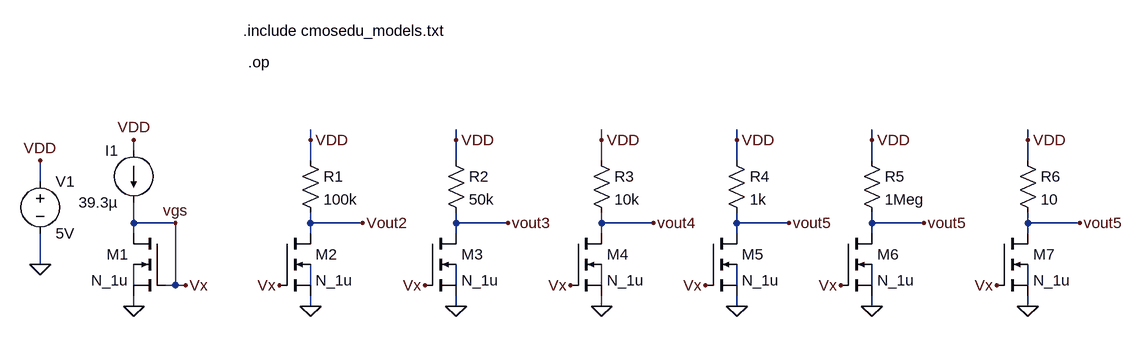
[diagram p0: schematic pt6.asc]
pt6.asc, the LTspice schematic file:
Version 4
SHEET 1 1736 680
WIRE 464 -64 464 -80
WIRE 688 -64 688 -80
WIRE 912 -64 912 -80
WIRE 1120 -64 1120 -80
WIRE 1328 -64 1328 -80
WIRE 1568 -64 1568 -80
WIRE 192 -48 192 -64
WIRE 464 -32 464 -64
WIRE 688 -32 688 -64
WIRE 912 -32 912 -64
WIRE 1120 -32 1120 -64
WIRE 1328 -32 1328 -64
WIRE 1568 -32 1568 -64
WIRE 48 0 48 -32
WIRE 192 64 192 32
WIRE 256 64 192 64
WIRE 464 64 464 48
WIRE 544 64 464 64
WIRE 688 64 688 48
WIRE 768 64 688 64
WIRE 912 64 912 48
WIRE 992 64 912 64
WIRE 1120 64 1120 48
WIRE 1200 64 1120 64
WIRE 1328 64 1328 48
WIRE 1408 64 1328 64
WIRE 1568 64 1568 48
WIRE 1648 64 1568 64
WIRE 192 80 192 64
WIRE 464 80 464 64
WIRE 688 80 688 64
WIRE 912 80 912 64
WIRE 1120 80 1120 64
WIRE 1328 80 1328 64
WIRE 1568 80 1568 64
WIRE 48 128 48 80
WIRE 192 160 192 128
WIRE 256 160 256 64
WIRE 256 160 240 160
WIRE 272 160 256 160
WIRE 464 160 464 128
WIRE 688 160 688 128
WIRE 912 160 912 128
WIRE 1120 160 1120 128
WIRE 1328 160 1328 128
WIRE 1568 160 1568 128
WIRE 192 192 192 176
WIRE 464 192 464 176
WIRE 688 192 688 176
WIRE 912 192 912 176
WIRE 1120 192 1120 176
WIRE 1328 192 1328 176
WIRE 1568 192 1568 176
FLAG 48 128 0
FLAG 192 192 0
FLAG 256 64 vgs
FLAG 48 -32 VDD
FLAG 192 -64 VDD
FLAG 464 192 0
FLAG 544 64 Vout2
FLAG 464 -64 VDD
FLAG 688 192 0
FLAG 768 64 vout3
FLAG 688 -64 VDD
FLAG 912 192 0
FLAG 992 64 vout4
FLAG 912 -64 VDD
FLAG 272 160 Vx
FLAG 416 160 Vx
FLAG 640 160 Vx
FLAG 864 160 Vx
FLAG 1120 192 0
FLAG 1200 64 vout5
FLAG 1120 -64 VDD
FLAG 1072 160 Vx
FLAG 1328 192 0
FLAG 1408 64 vout5
FLAG 1328 -64 VDD
FLAG 1280 160 Vx
FLAG 1568 192 0
FLAG 1648 64 vout5
FLAG 1568 -64 VDD
FLAG 1520 160 Vx
SYMBOL voltage 48 -16 R0
WINDOW 123 0 0 Left 2
WINDOW 39 0 0 Left 2
SYMATTR InstName V1
SYMATTR Value 5V
SYMBOL nmos4 240 80 M0
SYMATTR InstName M1
SYMATTR Value N_1u
SYMATTR Value2 l=1.5u w=3u
SYMBOL current 192 -48 M0
WINDOW 123 0 0 Left 2
WINDOW 39 0 0 Left 2
SYMATTR InstName I1
SYMATTR Value 39.3µ
SYMBOL nmos4 416 80 R0
SYMATTR InstName M2
SYMATTR Value N_1u
SYMATTR Value2 l=1.5u w=3u
SYMBOL nmos4 640 80 R0
SYMATTR InstName M3
SYMATTR Value N_1u
SYMATTR Value2 l=1.5u w=3u
SYMBOL nmos4 864 80 R0
SYMATTR InstName M4
SYMATTR Value N_1u
SYMATTR Value2 l=1.5u w=3u
SYMBOL res 448 -48 R0
SYMATTR InstName R1
SYMATTR Value 100k
SYMBOL res 672 -48 R0
SYMATTR InstName R2
SYMATTR Value 50k
SYMBOL res 896 -48 R0
SYMATTR InstName R3
SYMATTR Value 10k
SYMBOL nmos4 1072 80 R0
SYMATTR InstName M5
SYMATTR Value N_1u
SYMATTR Value2 l=1.5u w=3u
SYMBOL res 1104 -48 R0
SYMATTR InstName R4
SYMATTR Value 1k
SYMBOL nmos4 1280 80 R0
SYMATTR InstName M6
SYMATTR Value N_1u
SYMATTR Value2 l=1.5u w=3u
SYMBOL res 1312 -48 R0
SYMATTR InstName R5
SYMATTR Value 1Meg
SYMBOL nmos4 1520 80 R0
SYMATTR InstName M7
SYMATTR Value N_1u
SYMATTR Value2 l=1.5u w=3u
SYMBOL res 1552 -48 R0
SYMATTR InstName R6
SYMATTR Value 10
TEXT 360 -232 Left 2 !.include cmosedu_models.txt
TEXT 368 -184 Left 2 !.op

The netlist it stands for:
* pt6.asc
V1 VDD 0 5V
M1 Vx Vx 0 N001 N_1u l=1.5u w=3u
I1 VDD Vx 39.3µ
M2 Vout2 Vx 0 N002 N_1u l=1.5u w=3u
M3 vout3 Vx 0 N003 N_1u l=1.5u w=3u
M4 vout4 Vx 0 N004 N_1u l=1.5u w=3u
R1 VDD Vout2 100k
R2 VDD vout3 50k
R3 VDD vout4 10k
M5 vout5 Vx 0 N005 N_1u l=1.5u w=3u
R4 VDD vout5 1k
M6 vout5 Vx 0 N006 N_1u l=1.5u w=3u
R5 VDD vout5 1Meg
M7 vout5 Vx 0 N007 N_1u l=1.5u w=3u
R6 VDD vout5 10
.model NMOS NMOS
.model PMOS PMOS
.lib standard.mos
.include cmosedu_models.txt
.op
.backanno
.end